# EAGLE schematic CapstonePCB_Schem (EAGLE 9.6.2)
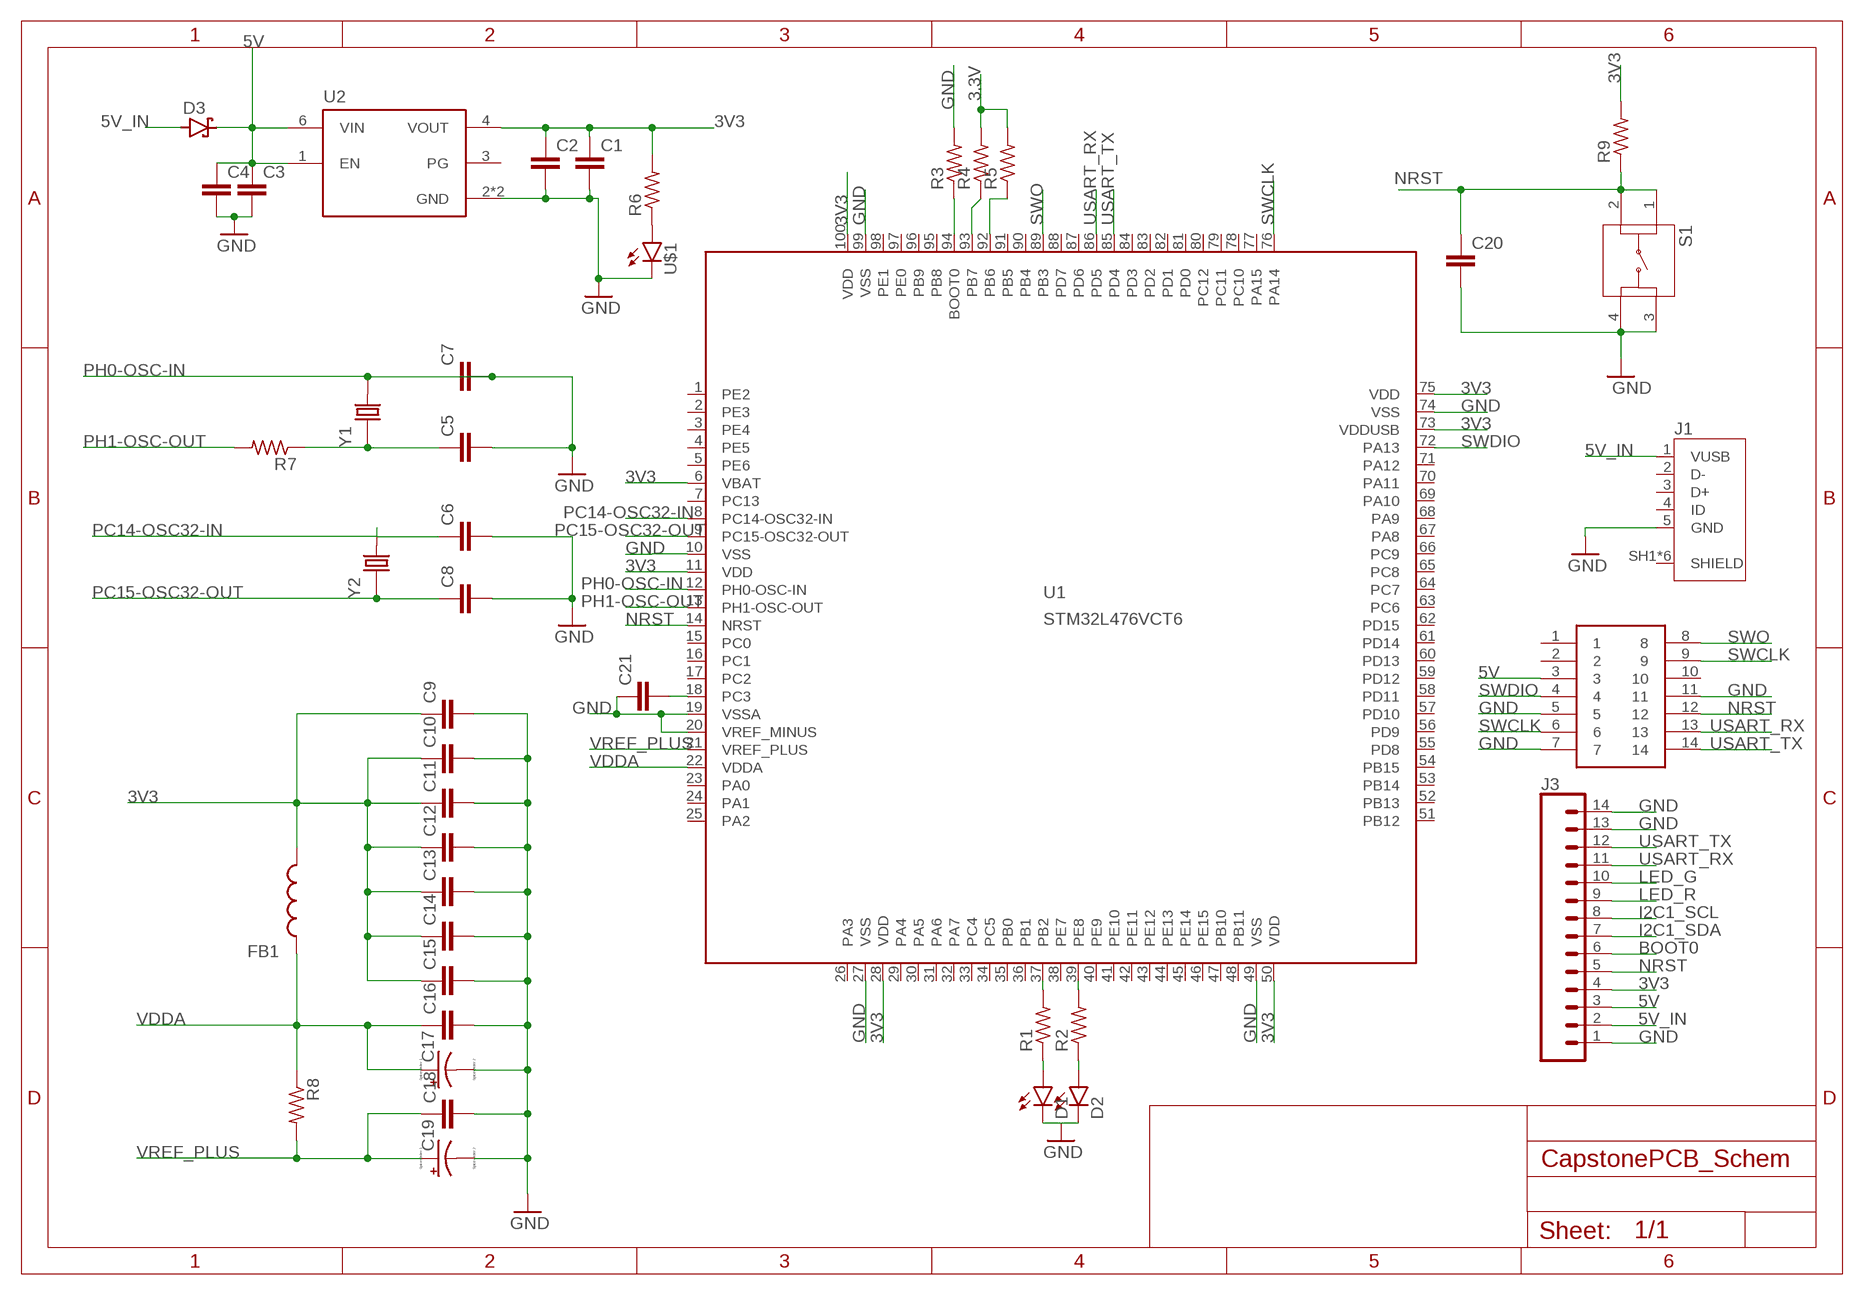
[diagram p0: schematic, sheet 1]

## Parts
C1  CC0402JRNPO9BN200  [CAPC1005X55N]
C2  CC0402JRNPO9BN200  [CAPC1005X55N]
C3  CC0402JRNPO9BN200  [CAPC1005X55N]
C4  CC0402JRNPO9BN200  [CAPC1005X55N]
C5  CC0402JRNPO9BN200  [CAPC1005X55N]
C6  CC0402JRNPO9BN200  [CAPC1005X55N]
C7  CC0402JRNPO9BN200  [CAPC1005X55N]
C8  CC0402JRNPO9BN200  [CAPC1005X55N]
C9  CC0603KRX5R7BB105  [CAPC1608X90]
C10  CC0603KRX5R7BB105  [CAPC1608X90]
C11  CC0603KRX5R7BB105  [CAPC1608X90]
C12  CC0603KRX5R7BB105  [CAPC1608X90]
C13  CC0603KRX5R7BB105  [CAPC1608X90]
C14  CC0603KRX5R7BB105  [CAPC1608X90]
C15  CC0603KRX5R7BB105  [CAPC1608X90]
C16  CC0603KRX5R7BB105  [CAPC1608X90]
C17  TAJA105K016RNJ  [CAPPM3216X180N]
C18  CC0603KRX5R7BB105  [CAPC1608X90]
C19  TAJA105K016RNJ  [CAPPM3216X180N]
C20  CC0402KRX7R7BB104  [CAPC1005X55N]
C21  CC0402JRNPO9BN200  [CAPC1005X55N]
D1  SML-P12MTT86  [LED_SML-P11UTT86R]
D2  SML-P12MTT86  [LED_SML-P11UTT86R]
D3  BAT54  [SOT23]
FB1  BK1608HS601-T  [BEADC1608X95N]
J1  10118192-0001LF  [AMPHENOL_10118192-0001LF]
J2  FTSH-107-01-L-DV-K-A  [FTSH10701LDVKA]
J3  CONN_14  [1X14]
R1  RC0402FR-071KL  [RESC1005X40N]
R2  RC0402FR-071KL  [RESC1005X40N]
R3  RC0402FR-071KL  [RESC1005X40N]
R4  RC0402FR-071KL  [RESC1005X40N]
R5  RC0402FR-071KL  [RESC1005X40N]
R6  RC0402FR-071KL  [RESC1005X40N]
R7  RC0402FR-071KL  [RESC1005X40N]
R8  RC0402FR-071KL  [RESC1005X40N]
R9  RC0402FR-071KL  [RESC1005X40N]
S1  LL3301FF065QJ  [LL3301FF065QJ]
U1  STM32L476VCT6  [LQFP100_14X14]
U2  LD39050PU33R  [SON95P300X300X100-7N]
U$1  19-213-R6C-AP1Q2B/3T  [CAPC0603X39N]
Y1  ECS-.327-12.5-12QS-TR  [XTAL_ECS-.327-12.5-12QS-TR]
Y2  ECS-.327-12.5-12QS-TR  [XTAL_ECS-.327-12.5-12QS-TR]

## Nets
3.3V: R4.2 R5.2
3V3: C1.1 C2.1 C9.1 C10.1 C11.1 C12.1 C13.1 C14.1 C15.1 FB1.2 J3.4 R6.2 R9.2 U1.6(VBAT) U1.11(VDD) U1.28(VDD) U1.50(VDD) U1.73(VDDUSB) U1.75(VDD) U1.100(VDD) U2.4(VOUT)
5V: C3.1 C4.1 D3.3(C) J2.3 J3.3 U2.1(EN) U2.6(VIN)
5V_IN: D3.1(A) J1.1(VUSB) J3.2
BOOT0: J3.6
GND: C1.2 C2.2 C3.2 C4.2 C6.2 C8.2 C9.2 C10.2 C11.2 C12.2 C13.2 C14.2 C15.2 C16.2 C17.C(-) C18.2 C19.C(-) C20.2 C21.1 D1.C D2.C J1.5(GND) J2.5 J2.7 J2.11 J3.1 J3.13 J3.14 R3.2 S1.3 S1.4 U1.10(VSS) U1.19(VSSA) U1.20(VREF_MINUS) U1.27(VSS) U1.49(VSS) U1.74(VSS) U1.99(VSS) U2.2(GND) U2.7(GND) U$1.2(C)
I2C1_SCL: J3.8
I2C1_SDA: J3.7
LED_G: J3.10
LED_R: J3.9
N$1: R2.2 U1.39(PE8)
N$2: R1.2 U1.37(PB2)
N$3: D1.A R1.1
N$4: D2.A R2.1
N$5: R5.1 U1.92(PB6)
N$6: R6.1 U$1.1(A)
N$7: R3.1 U1.94(BOOT0)
N$8: R4.1 U1.93(PB7)
N$10: C5.1 R7.1 Y1.1
N$20: C21.2 U1.18(PC3)
NRST: C20.1 J2.12 J3.5 R9.1 S1.1 S1.2 U1.14(NRST)
PC14-OSC32-IN: C6.1 U1.8(PC14-OSC32-IN) Y2.2
PC15-OSC32-OUT: C8.1 U1.9(PC15-OSC32-OUT) Y2.1
PH0-OSC-IN: C5.2 C7.1 C7.2 U1.12(PH0-OSC-IN) Y1.2 ; supply symbol labelled GND
PH1-OSC-OUT: R7.2 U1.13(PH1-OSC-OUT)
SWCLK: J2.6 J2.9 U1.76(PA14)
SWDIO: J2.4 U1.72(PA13)
SWO: J2.8 U1.89(PB3)
USART_RX: J2.13 J3.11 U1.86(PD5)
USART_TX: J2.14 J3.12 U1.85(PD4)
VDDA: C16.1 C17.A(+) FB1.1 R8.1 U1.22(VDDA)
VREF_PLUS: C18.1 C19.A(+) R8.2 U1.21(VREF_PLUS)
Unconnected: J1.2(D-) J1.3(D+) J1.4(ID) J1.SH1(SHIELD) J1.SH2(SHIELD) J1.SH3(SHIELD) J1.SH4(SHIELD) J1.SH5(SHIELD) J1.SH6(SHIELD) J2.1 J2.2 J2.10 U1.1(PE2) U1.2(PE3) U1.3(PE4) U1.4(PE5) U1.5(PE6) U1.7(PC13) U1.15(PC0) U1.16(PC1) U1.17(PC2) U1.23(PA0) U1.24(PA1) U1.25(PA2) U1.26(PA3) U1.29(PA4) U1.30(PA5) U1.31(PA6) U1.32(PA7) U1.33(PC4) U1.34(PC5) U1.35(PB0) U1.36(PB1) U1.38(PE7) U1.40(PE9) U1.41(PE10) U1.42(PE11) U1.43(PE12) U1.44(PE13) U1.45(PE14) U1.46(PE15) U1.47(PB10) U1.48(PB11) U1.51(PB12) U1.52(PB13) U1.53(PB14) U1.54(PB15) U1.55(PD8) U1.56(PD9) U1.57(PD10) U1.58(PD11) U1.59(PD12) U1.60(PD13) U1.61(PD14) U1.62(PD15) U1.63(PC6) U1.64(PC7) U1.65(PC8) U1.66(PC9) U1.67(PA8) U1.68(PA9) U1.69(PA10) U1.70(PA11) U1.71(PA12) U1.77(PA15) U1.78(PC10) U1.79(PC11) U1.80(PC12) U1.81(PD0) U1.82(PD1) U1.83(PD2) U1.84(PD3) U1.87(PD6) U1.88(PD7) U1.90(PB4) U1.91(PB5) U1.95(PB8) U1.96(PB9) U1.97(PE0) U1.98(PE1) U2.3(PG)

## Library data of the parts
C1-C8 C21 = ce-capstone:CC0402JRNPO9BN200: CAPACITOR CERAMIC 20PF 50V, C0G, 0402; Dielectric Characteristic:C0G / NP0; Capacitance:20pF; Capacitance Tolerance:± 5%; Voltage Rating:50V; Capacitor Case Style:0402; Capacitor Mounting:SMD; DESCRIPTION: 20pF ±5% 50V Ceramic Capacitor C0G, NP0 0402 _1005 Metric_; DIGI-KEY_PART_NUMBER: 311-1417-1-ND; DIGI-KEY_PURCHASE_URL: https://www.digikey.com/product-detail/en/yageo/CC0402JRNPO9BN200/311-1417-1-ND/2833723?utm_source=snapeda&utm_medium=aggregator&utm_campaign=symbol; MF: Yageo; MP: CC0402JRNPO9BN200; PACKAGE: 0402 Yageo
C9-C16 C18 = ce-capstone:CC0603KRX5R7BB105: CAPACITOR CERAMIC, 1µF, 10V, X5R, 0603; Dielectric Characteristic:X5R; Capacitance:1µF; Capacitance Tolerance:± 10%; Voltage Rating:16V; Temperature Coefficient:± 15%; Capacitor Case Style:0603; No. of Pins:2; Mounting Type:SMD ;RoHS Compliant: Yes; DESCRIPTION: 1µF ±10% 16V Ceramic Capacitor X5R 0603 _1608 Metric_; DIGI-KEY_PART_NUMBER: 311-1444-1-ND; DIGI-KEY_PURCHASE_URL: https://www.digikey.com/product-detail/en/yageo/CC0603KRX5R7BB105/311-1444-1-ND/2833750?utm_source=snapeda&utm_medium=aggregator&utm_campaign=symbol; MF: Yageo; MP: CC0603KRX5R7BB105; PACKAGE: 0603 Yageo
C17 C19 = ce-capstone:TAJA105K016RNJ: Capacitor tantalum TAJ 1206 1uF 16V AVX 1uF SMD Solid MnO2 Tantalum Electrolytic Capacitor, 16 V dc +/-10%, TAJ Series Source: Datasheet <http://www.farnell.com/datasheets/1680476.pdf>; ALLIED_NUMBER: 70474975; ALLIED_PRICE-STOCK: https://www.alliedelec.com/avx-taja105k016r/70474975/; DESCRIPTION: Capacitor tantalum TAJ 1206 1uF 16V AVX 1uF SMD Solid MnO2 Tantalum Electrolytic Capacitor, 16 V dc +/-10%, TAJ Series; HEIGHT: 1.8mm; MANUFACTURER_NAME: AVX; MANUFACTURER_PART_NUMBER: TAJA105K016RNJ; MOUSER_PART_NUMBER: 581-TAJA105K016RNJ; MOUSER_PRICE-STOCK: https://www.mouser.com/Search/Refine.aspx?Keyword=581-TAJA105K016R; RS_PART_NUMBER: 6992804P; RS_PRICE-STOCK: http://uk.rs-online.com/web/p/products/6992804P
C20 = ce-capstone:CC0402KRX7R7BB104: .1UF 16V 10% 0402; DESCRIPTION: 0.1µF ±10% 16V Ceramic Capacitor X7R 0402 _1005 Metric_; DIGI-KEY_PART_NUMBER: 311-1338-1-ND; DIGI-KEY_PURCHASE_URL: https://www.digikey.com/product-detail/en/yageo/CC0402KRX7R7BB104/311-1338-1-ND/2103122?utm_source=snapeda&utm_medium=aggregator&utm_campaign=symbol; MF: Yageo; MP: CC0402KRX7R7BB104; PACKAGE: 0402 Yageo
D1 D2 = ce-capstone:SML-P12MTT86: SML-P1 Series Red 0402 Clear 60 mcd 2 V Surface Mount PICOLED LED; AVAILABILITY: Unavailable; DESCRIPTION: Green 572nm LED Indication - Discrete 2V 0402 _1006 Metric_; MF: Rohm; MP: SML-P12MTT86; PACKAGE: 0402 Rohm; PRICE: None
D3 = ce-capstone:BAT54: Schottky Diodes Source: Fairchild .. BAT54.pdf
FB1 = ce-capstone:BK1608HS601-T: Ferrite Chip Bead(Lead Free) Source: Datasheet <https://www.tai-tech.com.tw/_upload/files/FCM1608-Series.pdf>; DESCRIPTION: Ferrite Chip Bead(Lead Free); HEIGHT: 0.95mm; MANUFACTURER_NAME: Taiyo Yuden; MANUFACTURER_PART_NUMBER: BK1608HS601-T
J1 = ce-capstone:10118192-0001LF: Single Port 5 Contact Horizontal Right Angle Shielded Micro B USB 2.0 Connector; AVAILABILITY: Unavailable; DESCRIPTION: USB - micro B USB 2.0 Receptacle Connector 5 Position Surface Mount, Right Angle; MF: Amphenol ICC; MP: 10118192-0001LF; PACKAGE: None; PRICE: None
J2 = ce-capstone:FTSH-107-01-L-DV-K-A: Headers & Wire Housings .050" Micro Terminal Strip Source: Datasheet <http://suddendocs.samtec.com/prints/ftsh-1xx-xx-xxx-dv-xxx-xxx-mkt.pdf>; DESCRIPTION: Headers & Wire Housings .050" Micro Terminal Strip; HEIGHT: 5.97mm; MANUFACTURER_NAME: SAMTEC; MANUFACTURER_PART_NUMBER: FTSH-107-01-L-DV-K-A; MOUSER_PART_NUMBER: 200-FTSH10701LDVKA; MOUSER_PRICE-STOCK: https://www.mouser.com/Search/Refine.aspx?Keyword=200-FTSH10701LDVKA
J3 = SparkFun-Connectors:CONN_14: Multi connection point. Often used as Generic Header-pin footprint for 0.1 inch spaced/style header connections On any of the 0.1 inch spaced packages, you can populate with these: Break Away Headers - Straight <https://www.sparkfun.com/products/116> (PRT-00116) Break Away Male Headers - Right Angle <https://www.sparkfun.com/products/553> (PRT-00553) Female Headers <https://www.sparkfun.com/products/115> (PRT-00115) Break Away Headers - Machine Pin <https://www.sparkfun.com/products/117> (PRT-00117) Break Away Female Headers - Swiss Machine Pin <https://www.sparkfun.com/products/743> (PRT-00743) For SCREWTERMINALS and SPRING TERMINALS visit here: Screw Terimnals on SparkFun.com <https://www.sparkfun.com/search/results?term=Screw+Terminals> (5mm/3.5mm/2.54mm spacing) This device is also useful as a general connection point to wire up your design to another part of your project. Our various solder wires solder well into these plated through hole pads. Hook-Up Wire - Assortment (Stranded, 22 AWG) <https://www.sparkfun.com/products/11375> (PRT-11375) Hook-Up Wire - Assortment (Solid Core, 22 AWG) <https://www.sparkfun.com/products/11367> (PRT-11367) View the entire wire category on our website here <https://www.sparkfun.com/categories/141> Special notes: Molex polarized connector foot print use with SKU : PRT-08231 with associated crimp pins and housings. 1MM SMD Version SKU: PRT-10208 NOTES ON THE VARIANTS LOCK and LOCK_LONGPADS... This footprint was designed to help hold the alignment of a through-hole component (i.e. 6-pin header) while soldering it into place. You may notice that each hole has been shifted either up or down by 0.005 of an inch from it's more standard position (which is a perfectly straight line). This slight alteration caused the pins (the squares in the middle) to touch the edges of the holes. Because they are alternating, it causes a "brace" to hold the component in place. 0.005 has proven to be the perfect amount of "off-center" position when using our standard breakaway headers. Although looks a little odd when you look at the bare footprint, once you have a header in there, the alteration is very hard to notice. Also,if you push a header all the way into place, it is covered up entirely on the bottom side.
R1-R9 = ce-capstone:RC0402FR-071KL: RES SMD 510 OHM 1% 1/16W 0402; DESCRIPTION: 510 Ohms ±1% 0.063W, 1/16W Chip Resistor 0402 _1005 Metric_ Moisture Resistant Thick Film; DIGI-KEY_PART_NUMBER: 311-510LRCT-ND; DIGI-KEY_PURCHASE_URL: https://www.digikey.com/product-detail/en/yageo/RC0402FR-07510RL/311-510LRCT-ND/729579?utm_source=snapeda&utm_medium=aggregator&utm_campaign=symbol; MF: Yageo; MP: RC0402FR-07510RL; PACKAGE: 1005 Panasonic Electronic Components
S1 = ce-capstone:LL3301FF065QJ: Pushbutton Switches 50mA 12VDC F065 7.0mm J-Lead Source: Datasheet <https://componentsearchengine.com/Datasheets/1/LL3301FF065QJ.pdf>; DESCRIPTION: Pushbutton Switches 50mA 12VDC F065 7.0mm J-Lead; HEIGHT: 7.3mm; MANUFACTURER_NAME: E-Switch; MANUFACTURER_PART_NUMBER: LL3301FF065QJ; MOUSER_PART_NUMBER: 612-LL3301FF065QJ; MOUSER_PRICE-STOCK: https://www.mouser.com/Search/Refine.aspx?Keyword=612-LL3301FF065QJ
U1 = ce-capstone:STM32L476V*: STM32L476VX LQFP100 Datasheet STM32L476XX <http://www.st.com/content/ccc/resource/technical/document/datasheet/c5/ed/2f/60/aa/79/42/0b/DM00108832.pdf/files/DM00108832.pdf/jcr:content/translations/en.DM00108832.pdf>; FARNELL: 2518171; FLASH: 256kB; SRAM: 128kB
U2 = ce-capstone:LD39050PU33R: LD39050 Series 500 mA 3.3 V Fixed Low Noise LDO Voltage Regulator - DFN-6; AVAILABILITY: Unavailable; DESCRIPTION: Linear Voltage Regulator IC 1 Output 500mA 6-DFN _3x3_; MF: STMicroelectronics; MP: LD39050PU33R; PACKAGE: DFN-6 STMicroelectronics; PRICE: None
U$1 = ce-capstone:19-213-R6C-AP1Q2B/3T
Y1 Y2 = ce-capstone:ECS-.327-12.5-12QS-TR: SMD CRYSTAL 32.768 KHz; AVAILABILITY: Unavailable; DESCRIPTION: 32.768kHz ±20ppm Crystal 12.5pF 90 kOhms 2-SMD, No Lead; MF: ECS Inc.; MP: ECS-.327-12.5-12QS-TR; PACKAGE: SMD-2 ECS International; PRICE: None